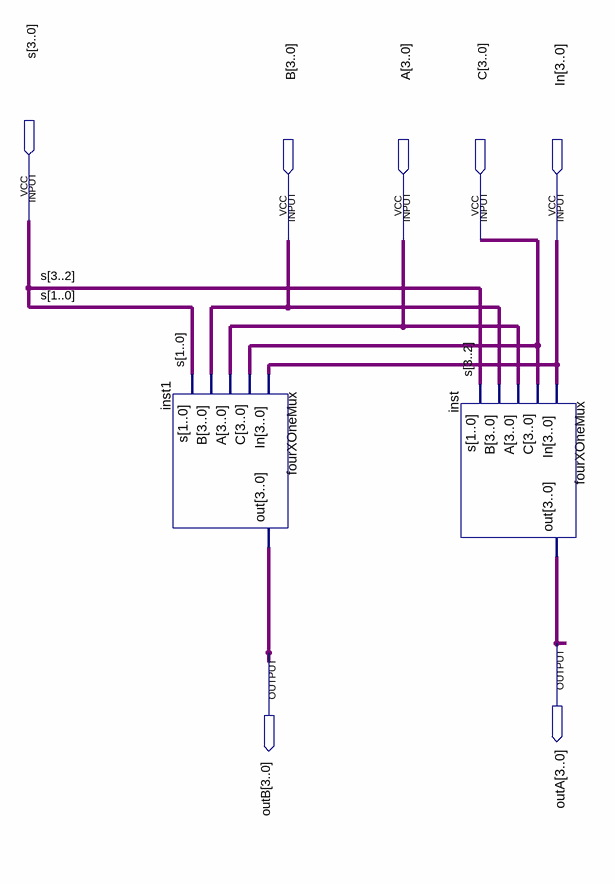
[diagram p0: schematic sheet]
// Quartus schematic source.bdf as structural Verilog: 2 symbols, 7 pins
module source (
  input  [3:0] s,
  input  [3:0] B,
  input  [3:0] A,
  input  [3:0] C,
  input  [3:0] In,
  output [3:0] outA,
  output [3:0] outB
);

  fourXOneMux inst1 (.In(In), .C(C), .A(A), .B(B), .s(s[1:0]), .out(outB));
  fourXOneMux inst (.In(In), .C(C), .A(A), .B(B), .s(s[3:2]), .out(outA));
endmodule
